# Altium schematic sheet [07] - HDMI.SchDoc
size A3; DocumentNumber: 2; SheetNumber: 7; SheetTotal: 20
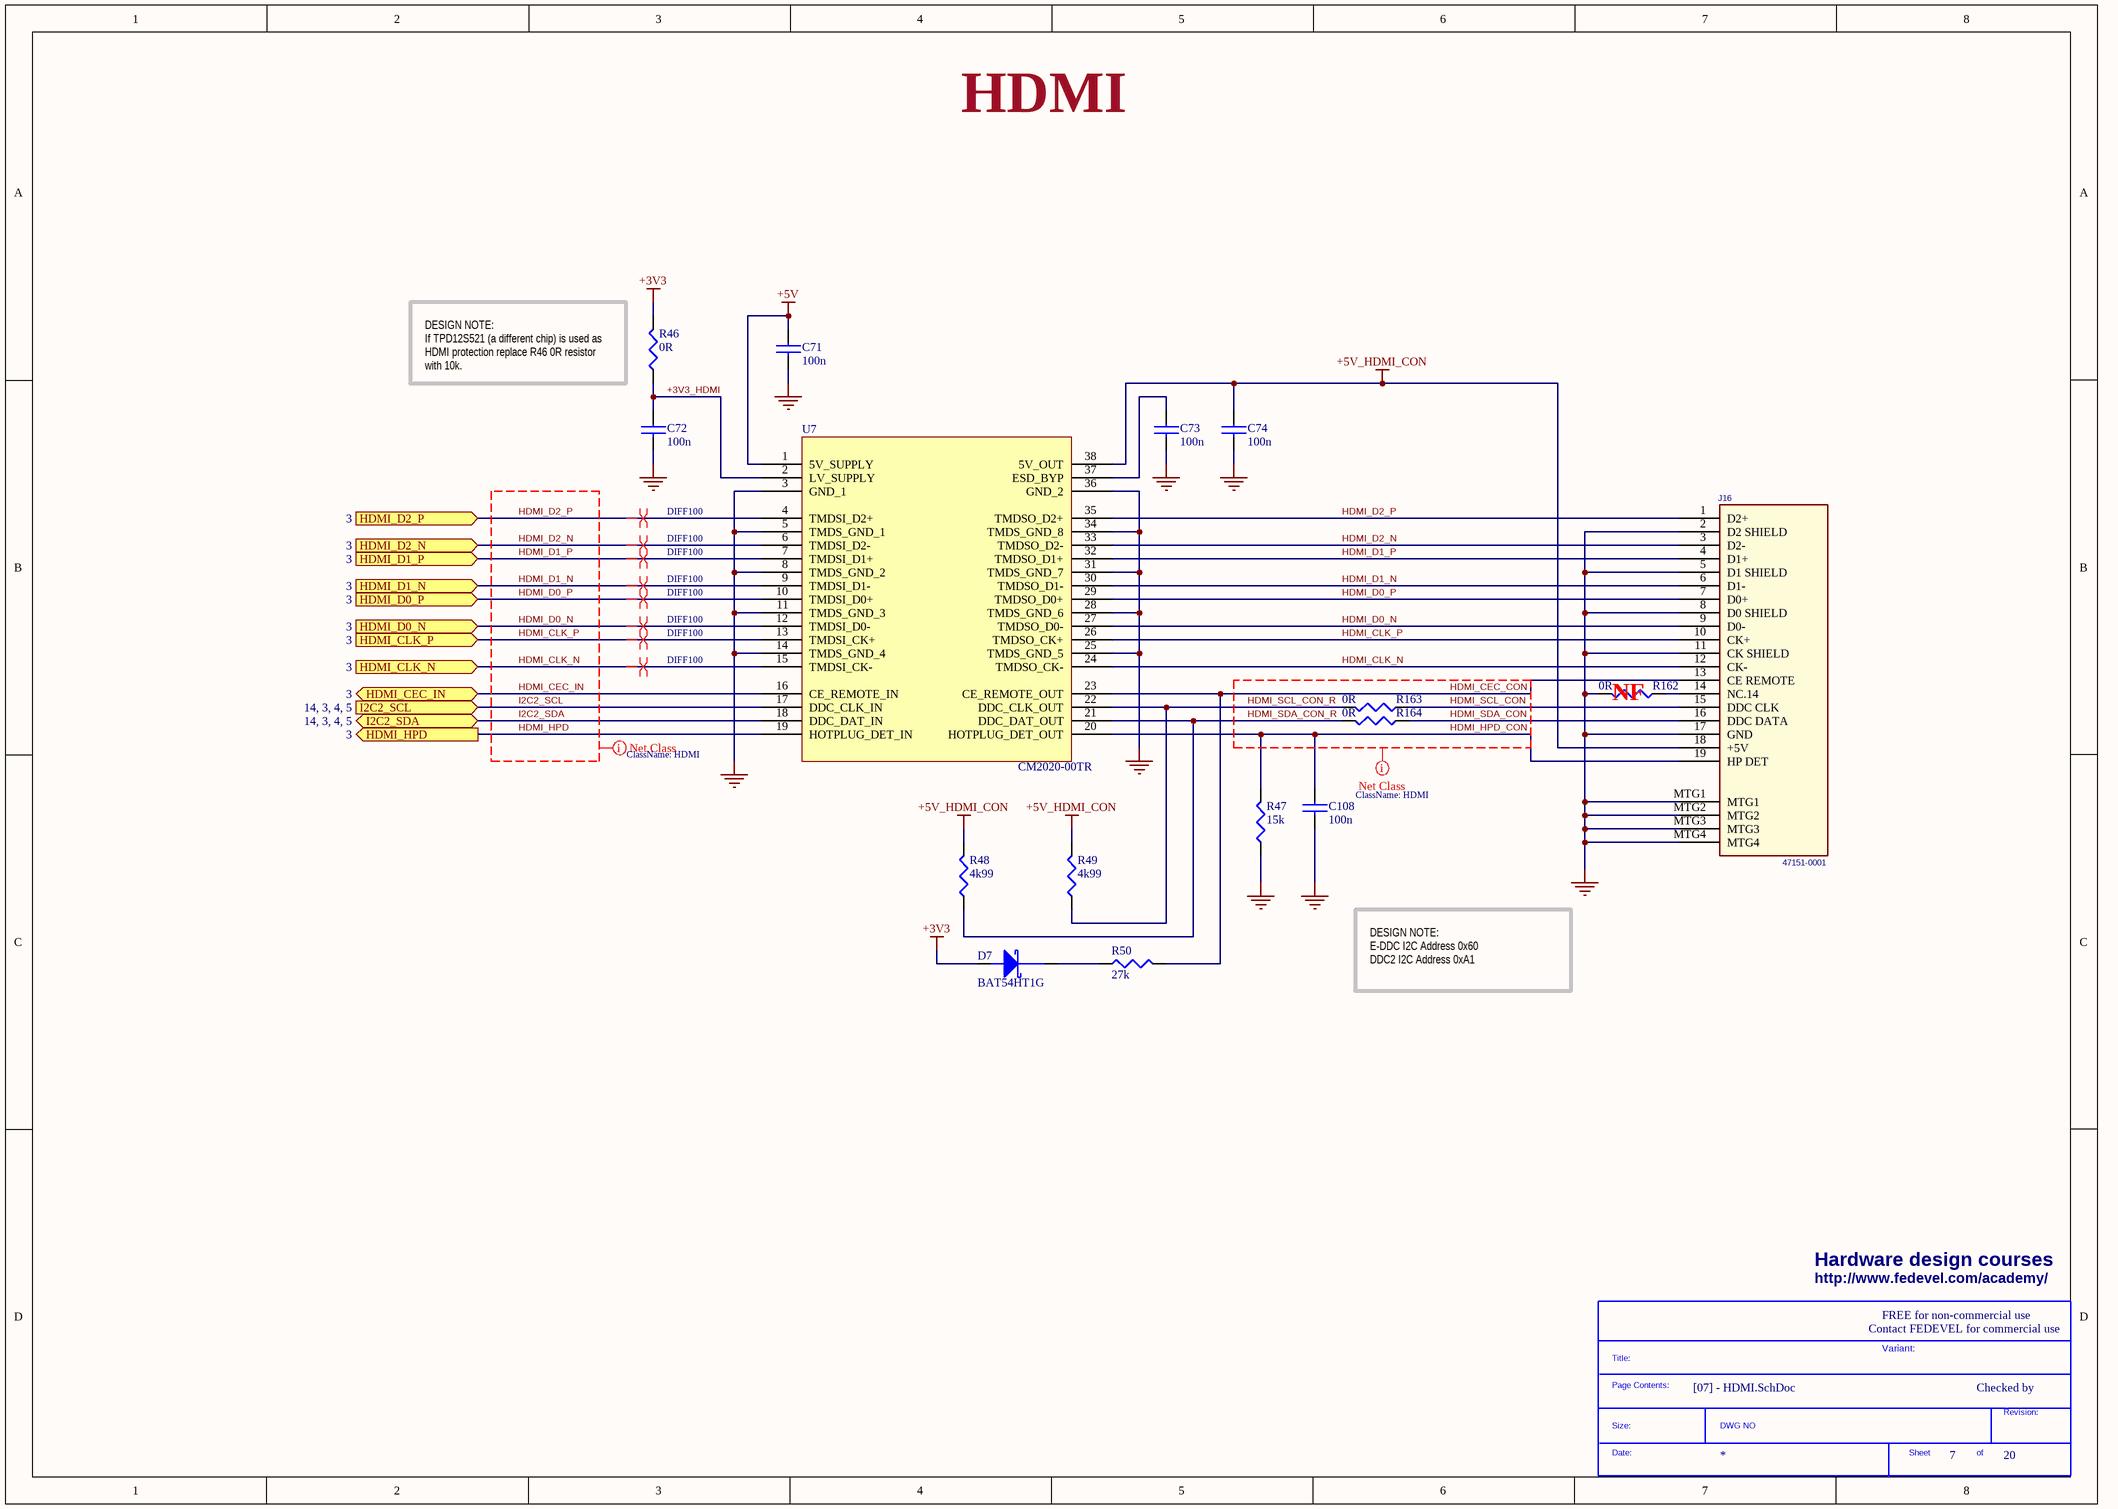
[diagram p0: [07] - HDMI.SchDoc]

## Parts
*  SDTitleBlock  (value not drawn)  (graphical)
C71  100n  [C0402]
C72  100n  [C0402]
C73  100n  [C0402]
C74  100n  [C0402]
C108  100n  [C0402]
D7  BAT54HT1G  [SOD323]
J16  47151-0001  [HDMI]
R46  0R  [R0402]
R47  15k  [R0402]
R48  4k99  [R0402]
R49  4k99  [R0402]
R50  27k  [R0402]
R162  0R  [R0402]
R163  0R  [R0402]
R164  0R  [R0402]
U7  CM2020-00TR  [TSSOP_38]

## Ports
HDMI_CEC_IN (bidir, see 3), HDMI_CLK_N (in, see 3), HDMI_CLK_P (in, see 3), HDMI_D0_N (in, see 3), HDMI_D0_P (in, see 3), HDMI_D1_N (in, see 3), HDMI_D1_P (in, see 3), HDMI_D2_N (in, see 3), HDMI_D2_P (in, see 3), HDMI_HPD (out, see 3), I2C2_SCL (see 14, 3, 4, 5), I2C2_SDA (bidir, see 14, 3, 4, 5)

## Nets
+3V3: D7.2(Anode) R46.2
+5V: C71.1 U7.1(5V_SUPPLY)
+5V_HDMI_CON: C74.1 J16.18(+5V) R48.2 R49.2 U7.38(5V_OUT)
GND: C71.2 C72.2 C73.2 C74.2 C108.2 J16.2(D2_SHIELD) J16.5(D1_SHIELD) J16.8(D0_SHIELD) J16.11(CK_SHIELD) J16.17(GND) J16.MTG1 J16.MTG2 J16.MTG3 J16.MTG4 R47.1 R162.2 U7.3(GND_1) U7.5(TMDS_GND_1) U7.8(TMDS_GND_2) U7.11(TMDS_GND_3) U7.14(TMDS_GND_4) U7.25(TMDS_GND_5) U7.28(TMDS_GND_6) U7.31(TMDS_GND_7) U7.34(TMDS_GND_8) U7.36(GND_2)
+3V3_HDMI: C72.1 R46.1 U7.2(LV_SUPPLY)
HDMI_CEC_CON: J16.13(CE_REMOTE) R50.2 U7.23(CE_REMOTE_OUT)
HDMI_CEC_IN: U7.16(CE_REMOTE_IN) ; port HDMI_CEC_IN
HDMI_CLK_N: J16.12(CK-) U7.15(TMDSI_CK-) U7.24(TMDSO_CK-) ; port HDMI_CLK_N
HDMI_CLK_P: J16.10(CK+) U7.13(TMDSI_CK+) U7.26(TMDSO_CK+) ; port HDMI_CLK_P
HDMI_D0_N: J16.9(D0-) U7.12(TMDSI_D0-) U7.27(TMDSO_D0-) ; port HDMI_D0_N
HDMI_D0_P: J16.7(D0+) U7.10(TMDSI_D0+) U7.29(TMDSO_D0+) ; port HDMI_D0_P
HDMI_D1_N: J16.6(D1-) U7.9(TMDSI_D1-) U7.30(TMDSO_D1-) ; port HDMI_D1_N
HDMI_D1_P: J16.4(D1+) U7.7(TMDSI_D1+) U7.32(TMDSO_D1+) ; port HDMI_D1_P
HDMI_D2_N: J16.3(D2-) U7.6(TMDSI_D2-) U7.33(TMDSO_D2-) ; port HDMI_D2_N
HDMI_D2_P: J16.1(D2+) U7.4(TMDSI_D2+) U7.35(TMDSO_D2+) ; port HDMI_D2_P
HDMI_HPD: U7.19(HOTPLUG_DET_IN) ; port HDMI_HPD
HDMI_HPD_CON: C108.1 J16.19(HP_DET) R47.2 U7.20(HOTPLUG_DET_OUT)
HDMI_SCL_CON: J16.15(DDC_CLK) R163.1
HDMI_SCL_CON_R: R49.1 R163.2 U7.22(DDC_CLK_OUT)
HDMI_SDA_CON: J16.16(DDC_DATA) R164.1
HDMI_SDA_CON_R: R48.1 R164.2 U7.21(DDC_DAT_OUT)
I2C2_SCL: U7.17(DDC_CLK_IN) ; port I2C2_SCL
I2C2_SDA: U7.18(DDC_DAT_IN) ; port I2C2_SDA
NetC73_1: C73.1 U7.37(ESD_BYP)
NetD7_1: D7.1(Cathode) R50.1
NetJ16_14: J16.14(NC.14) R162.1

## Layout directives
net class HDMI: HDMI_CEC_CON, HDMI_CEC_IN, HDMI_CLK_N, HDMI_CLK_P, HDMI_D0_N, HDMI_D0_P, HDMI_D1_N, HDMI_D1_P, HDMI_D2_N, HDMI_D2_P, HDMI_HPD, HDMI_HPD_CON, HDMI_SCL_CON, HDMI_SCL_CON_R, HDMI_SDA_CON, HDMI_SDA_CON_R, I2C2_SCL, I2C2_SDA
differential pair; net class DIFF100: HDMI_CLK_N, HDMI_CLK_P, HDMI_D0_N, HDMI_D0_P, HDMI_D1_N, HDMI_D1_P, HDMI_D2_N, HDMI_D2_P

## Notes on the sheet
- HDMI
- DESIGN NOTE:
  If TPD12S521 (a different chip) is used as HDMI protection replace R46 0R resistor with 10k.
- (near R162) NF
- DESIGN NOTE:
  E-DDC I2C Address 0x60
  DDC2 I2C Address 0xA1
- Hardware design courses
- http://www.fedevel.com/academy/
- Contact FEDEVEL for commercial use
- FREE for non-commercial use
- Variant:
- Checked by
- (in symbol SDTitleBlock) Title:; Page Contents:; Revision:; Size:; DWG NO; Date:; Sheet; of

## Library data of the parts
C71-C74 C108 = C1005X5R1H104K: CAP CER .10UF 50V X5R 10% 0402; Manufacturer: TDK Corporation; Capacitance: 0.1µF; Value: 100nF; .Checked PCB: used; Description: CAP CER 0.1UF 50V 10% X5R 0402; Category: Capacitors; Supplier Part Number: 445-5942-1-ND; Manufacturer Part Number: C1005X5R1H104K; Operating Temperature: -55°C ~ 85°C; Package / Case: 0402 (1005 Metric); Price 1k [$]: 0.02340; .Checked SCH: used; Voltage - Rated: 50V; Supplier: Digikey; Supplier 1: Digi-Key; Supplier Part Number 1: 445-5942-1-ND; RoHS: RoHS Compliant; Stock 1: 106926; Pricing 1: 1=0.27, 10=0.18, 100=0.072, 250=0.05176, 500=0.0369, 1000=0.027 (USD); Tolerance: ±10%; Temperature Coefficient: X5R; Mounting Type: Surface Mount, MLCC; Applications: General Purpose; Ratings: -; Size / Dimension: 0.039" L x 0.020" W (1.00mm x 0.50mm); Height - Seated (Max): -; Thickness (Max): 0.022" (0.55mm); Lead Spacing: -; Features: -; Packaging: Cut Tape (CT); Lead Style: -; ComponentLink1URL: http://www.tdk.co.jp/tefe02/e412_c.pdf; ComponentLink1Description: http://www.tdk.co.jp/tefe02/e412_c.pdf
D7 = BAT54HT1G: DIODE SCHOTTKY 30V 0.2A SOD323; Manufacturer: Fairchild Semiconductor; Current - Average Rectified (Io): 200mA; Voltage - Forward (Vf) (Max) @ If: 800mV @ 100mA; Speed: Small Signal =< 200mA (Io), Any Speed; Reverse Recovery Time (trr): 5ns; Current - Reverse Leakage @ Vr: 2µA @ 25V; Capacitance @ Vr, F: 10pF @ 1V, 1MHz; Thermal Resistance: 600°C/W Ja; .Creator: MM; .Checked PCB: RF, used by MM; Supplier 1: Digi-Key; Manufacturer Part Number: BAT54HT1G; RoHS: RoHS Compliant; Category: Discrete Semiconductor Products; Stock 1: 11388; Pricing 1: 1=0.3, 10=0.276, 25=0.1984, 100=0.1543, 250=0.09696, 500=0.0826, 1000=0.05628 (USD); Packaging: Cut Tape (CT); Diode Type: Schottky; Voltage - DC Reverse (Vr) (Max): 30V; Mounting Type: Surface Mount; Package / Case: SC-76, SOD-323; Supplier Device Package: SOD-323; Operating Temperature - Junction: -55°C ~ 150°C; ComponentLink1URL: http://www.fairchildsemi.com/ds/BA/BAT54HT1G.pdf; ComponentLink1Description: http://www.fairchildsemi.com/ds/BA/BAT54HT1G.pdf; Supplier Part Number 1: BAT54HT1GCT-ND; .Checked SCH: MM
J16 = 47151-0001: CONN RCPT 19POS HDMI RT ANG SMD; Manufacturer: Molex Connector Corporation; .Checked PCB: used; Number of Positions: 19; Pitch: 0.50mm (.020"); Gender: Receptacle; .Checked SCH: used; Category: Connectors, Interconnects; Connector Type: HDMI; Family: USB, IEEE-1394 (Firewire), DVI, HDMI; Manufacturer Part Number: 47151-0001; Operating Temperature: -20°C to +85°C; Price 1k [$]: 1.74610; Supplier: Digikey; Supplier Part Number: WM19086CT-ND; Value: 47151-0001; Supplier 1: Digi-Key; Supplier Part Number 1: WM19086CT-ND; RoHS: RoHS Compliant; Stock 1: 2756; Pricing 1: 1=3.1, 10=2.57, 50=2.1456, 100=1.9034 (USD); Number of Contacts: 19; Specifications: -; Mounting Type: Surface Mount, Right Angle, Horizontal; Features: Detent Lock; Packaging: Cut Tape (CT); Ingress Protection: -; ComponentLink1URL: http://www.molex.com/pdm_docs/sd/471510001_sd.pdf; ComponentLink1Description: http://www.molex.com/pdm_docs/sd/471510001_sd.pdf
R46 R162-R164 = RC0402JR-070RL: RES 0.0 OHM 1/16W 0402 SMD; Manufacturer: Yageo; Resistance (Ohms): 0.0; Power (Watts): 0.063W, 1/16W; Tolerance: Jumper; .Checked PCB: used; Category: Resistors; Manufacturer Part Number: RC0402JR-070RL; Package / Case: 0402 (1005 Metric); Price 1k [$]: 0.01389; Value: 0R; .Checked SCH: used; Supplier Part Number: 311-0.0JRCT-ND; Supplier: Digikey; Supplier 1: Digi-Key; Supplier Part Number 1: 311-0.0JRCT-ND; RoHS: RoHS Compliant; Stock 1: 1106330; Pricing 1: 10=0.012, 50=0.009, 100=0.0069, 250=0.00512, 500=0.0038, 1000=0.00253 (USD); Composition: Thick Film; Features: -; Temperature Coefficient: -; Size / Dimension: 0.039" L x 0.020" W (1.00mm x 0.50mm); Height: 0.016" (0.40mm); Number of Terminations: 2; Packaging: Cut Tape (CT); ComponentLink1URL: http://www.yageo.com/documents/recent/PYu-RC0402_51_RoHS_L_6.pdf; ComponentLink1Description: http://www.yageo.com/documents/recent/PYu-RC0402_51_RoHS_L_6.pdf
R47 = RC0402FR-0715KL: RES 15.0K OHM 1/16W 1% 0402 SMD; Manufacturer: Yageo; Power (Watts): 0.063W, 1/16W; .Checked PCB: used; Temperature Coefficient: ±100ppm/°C; Category: Resistors; Supplier Part Number: 311-15.0KLRCT-ND; Manufacturer Part Number: RC0402FR-0715KL; Package / Case: 0402 (1005 Metric); Price 1k [$]: 0.01421; Resistance (Ohms): 15K; Tolerance: ±1%; Value: 15k; .Checked SCH: used; Supplier: Digikey; Supplier 1: Digi-Key; Supplier Part Number 1: 311-15.0KLRCT-ND; RoHS: RoHS Compliant; Stock 1: 31992; Pricing 1: 10=0.014, 50=0.0104, 100=0.0079, 250=0.00584, 500=0.00432, 1000=0.00288 (USD); Composition: Thick Film; Features: -; Size / Dimension: 0.039" L x 0.020" W (1.00mm x 0.50mm); Height: 0.016" (0.40mm); Number of Terminations: 2; Packaging: Cut Tape (CT); ComponentLink1URL: http://www.yageo.com/documents/recent/PYu-RC0402_51_RoHS_L_6.pdf; ComponentLink1Description: http://www.yageo.com/documents/recent/PYu-RC0402_51_RoHS_L_6.pdf
R48 R49 = RMCF0402FT4K99: RES TF 4.99K OHM 1% 1/16W 0402; Manufacturer: Stackpole Electronics Inc; Power (Watts): 0.063W, 1/16W; .Checked PCB: used; Temperature Coefficient: ±100ppm/°C; Category: Resistors; Supplier Part Number: RMCF0402FT4K99CT-ND; Manufacturer Part Number: RMCF0402FT4K99; Package / Case: 0402 (1005 Metric); Price 1k [$]: 0.00384; Resistance (Ohms): 4.99K; Tolerance: ±1%; Value: 4k99; .Checked SCH: used; Supplier: Digikey; Supplier 1: Digi-Key; Supplier Part Number 1: RMCF0402FT4K99CT-ND; RoHS: RoHS Compliant; Stock 1: 48509; Pricing 1: 1=0.04, 10=0.025, 50=0.0138, 100=0.0105, 250=0.0078, 500=0.00576, 1000=0.00384 (USD); Composition: Thick Film; Features: -; Size / Dimension: 0.039" L x 0.020" W (1.00mm x 0.50mm); Height: 0.016" (0.40mm); Number of Terminations: 2; Packaging: Cut Tape (CT); ComponentLink1URL: http://www.seielect.com/Catalog/SEI-RMCF.pdf; ComponentLink1Description: http://www.seielect.com/Catalog/SEI-RMCF.pdf
R50 = RC0402FR-0727KL: RES 27.0K OHM 1/16W 1% 0402 SMD; Manufacturer: Yageo; Power (Watts): 0.063W, 1/16W; .Checked PCB: RF; Temperature Coefficient: ±100ppm/°C; Category: Resistors; Supplier Part Number: 311-27.0KLRCT-ND; Manufacturer Part Number: RC0402FR-0727KL; Package / Case: 0402 (1005 Metric); Price 1k [$]: 0.00288; Resistance (Ohms): 27K; Tolerance: ±1%; Value: 27k; .Checked SCH: RF; Supplier: Digikey; Supplier 1: Digi-Key; Supplier Part Number 1: 311-27.0KLRCT-ND; RoHS: RoHS Compliant; Stock 1: 21638; Pricing 1: 10=0.014, 50=0.0104, 100=0.0079, 250=0.00584, 500=0.00432, 1000=0.00288 (USD); Composition: Thick Film; Features: -; Size / Dimension: 0.039" L x 0.020" W (1.00mm x 0.50mm); Height: 0.016" (0.40mm); Number of Terminations: 2; Packaging: Cut Tape (CT); ComponentLink1URL: http://www.yageo.com/documents/recent/PYu-RC0402_51_RoHS_L_6.pdf; ComponentLink1Description: http://www.yageo.com/documents/recent/PYu-RC0402_51_RoHS_L_6.pdf
U7 = CM2020-00TR: IC HDMI TX PORT P/I 38-TSSOP; Manufacturer: ON Semiconductor; .Creator: MM; .Checked PCB: RF, used by MM; Supplier 1: Digi-Key; Manufacturer Part Number: CM2020-00TR; RoHS: RoHS Compliant; Category: Integrated Circuits (ICs); Stock 1: 7580; Pricing 1: 1=1.52, 10=1.34, 25=1.2096, 100=1.0584, 250=0.9282, 500=0.8232, 1000=0.651 (USD); Packaging: Cut Tape (CT); Type: HDMI Transmitter; Applications: Consumer Electronics, DVD-RW Players, Set Top Box; Mounting Type: Surface Mount; Package / Case: 38-TFSOP (0.173", 4.40mm Width) Exposed Pad; Supplier Device Package: 38-TSSOP; ComponentLink1URL: http://www.onsemi.com/pub_link/Collateral/CM2020-00TR-D.PDF; ComponentLink1Description: http://www.onsemi.com/pub_link/Collateral/CM2020-00TR-D.PDF; Supplier Part Number 1: CM2020-00TROSCT-ND; .Checked SCH: RF, used by MM